# EAGLE design CircuitPlayground_ESP12_555_004 (EAGLE 7.1.0)
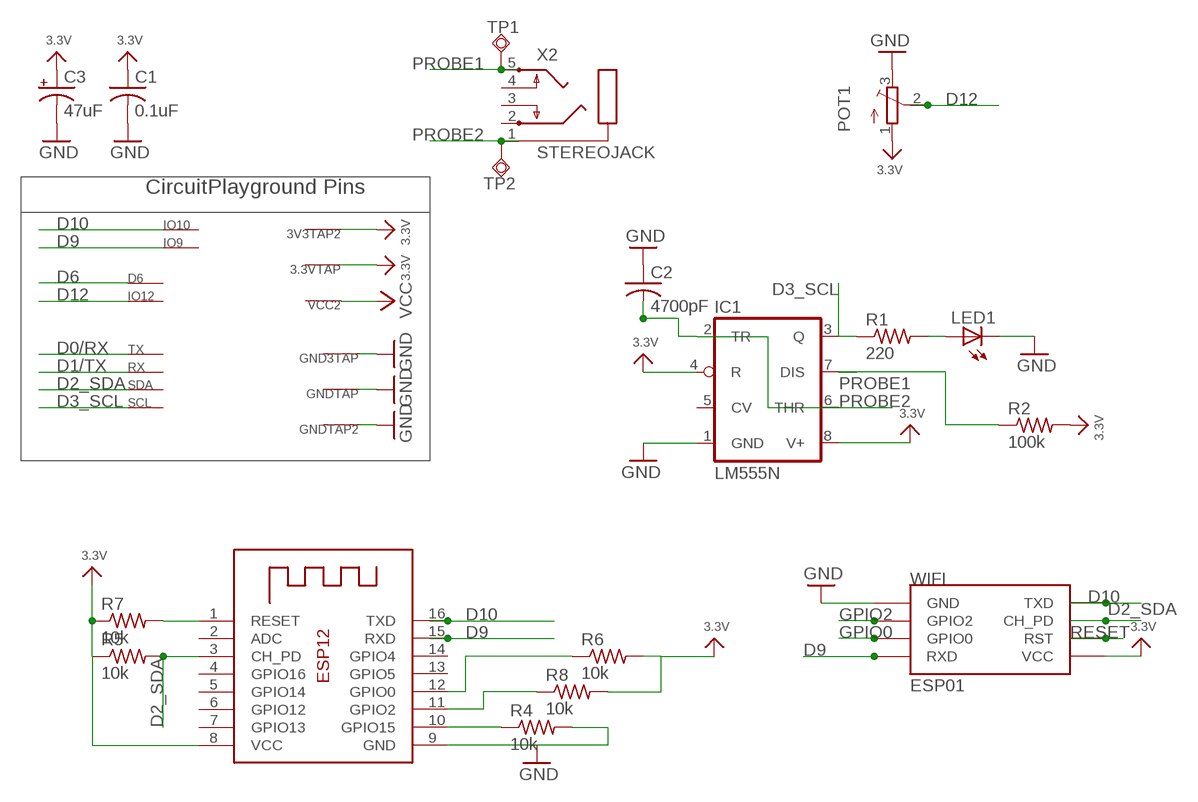
[diagram p0: schematic, sheet 1]

## Parts
3.3VTAP  SEWTAP-ALLIGATOR  [SEWALLI]
3V3TAP2  SEWTAP-ALLIGATOR  [SEWALLI]
C1  0.1uF  C-US025-030X050  [C025-030X050]
C2  4700pF  C-US025-030X050  [C025-030X050]
C3  47uF  CPOL-USE2-4  [E2-4]
D6  SEWTAP-ALLIGATOR  [SEWALLI]
GND3TAP  SEWTAP-ALLIGATOR  [SEWALLI]
GNDTAP  SEWTAP-ALLIGATOR  [SEWALLI]
GNDTAP2  SEWTAP-ALLIGATOR  [SEWALLI]
IC1  LM555N  [DIL08-ROUND]
IO9  SEWTAP-ALLIGATOR  [SEWALLI]
IO10  SEWTAP-ALLIGATOR  [SEWALLI]
IO12  SEWTAP-ALLIGATOR  [SEWALLI]
LED1  LED5MM  [LED5MM]
POT1  TRIMPOT3386  [TRIM-3386]
R1  220  R-US_R1206  [R1206]
R2  100k  R-US_R1206  [R1206]
R4  10k  R-US_R1206  [R1206]
R5  10k  R-US_R1206  [R1206]
R6  10k  R-US_R1206  [R1206]
R7  10k  R-US_R1206  [R1206]
R8  10k  R-US_R1206  [R1206]
RX  SEWTAP-ALLIGATOR  [SEWALLI]
SCL  SEWTAP-ALLIGATOR  [SEWALLI]
SDA  SEWTAP-ALLIGATOR  [SEWALLI]
TP1  TPSQTP20R  [TP20R]
TP2  TPSQTP20R  [TP20R]
TX  SEWTAP-ALLIGATOR  [SEWALLI]
VCC2  SEWTAP-ALLIGATOR  [SEWALLI]
WIFI  ESP01  [ESP01]
X1  ESP-12  [ESP-12]
X2  STEREOJACK  [STX3100]

## Nets
3.3V: 3.3VTAP.P$1(SEW) 3V3TAP2.P$1(SEW) C1.1 C3.+ IC1.4(R) IC1.8(V+) POT1.1(A) R2.2 R5.1 R6.2 R7.1 R8.2 WIFI.VCC X1.8(VCC)
D0/RX: TX.P$1(SEW)
D1/TX: RX.P$1(SEW)
D2_SDA: R5.2 SDA.P$1(SEW) WIFI.CH_PD X1.3(CH_PD)
D3_SCL: IC1.3(Q) R1.1 SCL.P$1(SEW)
D6: D6.P$1(SEW)
D9: IO9.P$1(SEW) WIFI.RX(RXD) X1.15(RXD)
D10: IO10.P$1(SEW) WIFI.TX(TXD) X1.16(TXD)
D12: IO12.P$1(SEW) POT1.2(S)
GND: C1.2 C2.1 C3.- GND3TAP.P$1(SEW) GNDTAP2.P$1(SEW) GNDTAP.P$1(SEW) IC1.1(GND) LED1.K(C) POT1.3(E) R4.2 WIFI.GND X1.9(GND)
GPIO0: R6.1 WIFI.GPIO0 X1.12(GPIO0)
GPIO2: R8.1 WIFI.GPIO2 X1.11(GPIO2)
N$1: R4.1 X1.10(GPIO15)
N$2: LED1.A R1.2
PROBE1: IC1.7(DIS) R2.1 TP1.TP X2.5
PROBE2: C2.2 IC1.2(TR) IC1.6(THR) TP2.TP X2.1
RESET: R7.2 WIFI.RST X1.1(RESET)
VCC: VCC2.P$1(SEW)
Unconnected: IC1.5(CV) X1.2(ADC) X1.4(GPIO16) X1.5(GPIO14) X1.6(GPIO12) X1.7(GPIO13) X1.13(GPIO5) X1.14(GPIO4) X2.2 X2.3 X2.4

## Notes on the sheet
- CircuitPlayground Pins

## Library data of the parts
3.3VTAP 3V3TAP2 D6 GND3TAP GNDTAP GNDTAP2 IO9 IO10 IO12 RX SCL SDA TX VCC2 = microbuilder:SEWTAP
C1 C2 = adafruit:C-US: CAPACITOR, American symbol
C3 = adafruit:CPOL-US: POLARIZED CAPACITOR, American symbol
IC1 = adafruit:*555: TIMER Changed DIP package to have round (not oval) pin pads http://www.ladyada.net/library/pcb/eaglelibrary.html
LED1 = adafruit:LED: LED OSRAM: - CHIPLED LG R971, LG N971, LY N971, LG Q971, LY Q971, LO R971, LY R971 LH N974, LH R974 LS Q976, LO Q976, LY Q976 LO Q996 - Hyper CHIPLED LW Q18S LB Q993, LB Q99A, LB R99A - SideLED LS A670, LO A670, LY A670, LG A670, LP A670 LB A673, LV A673, LT A673, LW A673 LH A674 LY A675 LS A676, LA A676, LO A676, LY A676, LW A676 LS A679, LY A679, LG A679 - Hyper Micro SIDELED® LS Y876, LA Y876, LO Y876, LY Y876 LT Y87S - SmartLED LW L88C, LW L88S LB L89C, LB L89S, LG L890 LS L89K, LO L89K, LY L89K LS L896, LA L896, LO L896, LY L896 - TOPLED LS T670, LO T670, LY T670, LG T670, LP T670 LSG T670, LSP T670, LSY T670, LOP T670, LYG T670 LG T671, LOG T671, LSG T671 LB T673, LV T673, LT T673, LW T673 LH T674 LS T676, LA T676, LO T676, LY T676, LB T676, LH T676, LSB T676, LW T676 LB T67C, LV T67C, LT T67C, LS T67K, LO T67K, LY T67K, LW E67C LS E67B, LA E67B, LO E67B, LY E67B, LB E67C, LV E67C, LT E67C LW T67C LS T679, LY T679, LG T679 LS T770, LO T770, LY T770, LG T770, LP T770 LB T773, LV T773, LT T773, LW T773 LH T774 LS E675, LA E675, LY E675, LS T675 LS T776, LA T776, LO T776, LY T776, LB T776 LHGB T686 LT T68C, LB T68C - Hyper Mini TOPLED® LB M676 - Mini TOPLED Santana® LG M470 LS M47K, LO M47K, LY M47K Source: http://www.osram.convergy.de/
POT1 = adafruit:TRIMPOT: SMT trimmer potentiometer part number TC33X http://www.ladyada.net/library/eagle
R1 R2 R4-R8 = adafruit:R-US_: RESISTOR, American symbol
TP1 TP2 = testpad:TPSQ: Test pad
WIFI = esp8266modules:ESP01: ESP8266 Wifi module 01
X1 = adafruit:ESP-12
X2 = adafruit:STEREOJACK: MIC/HEADPHONE JACK Stereo jack with two switches. Kycon STX3100, CUI SJ1-3555NG and/or 4UCon 05544

## Board
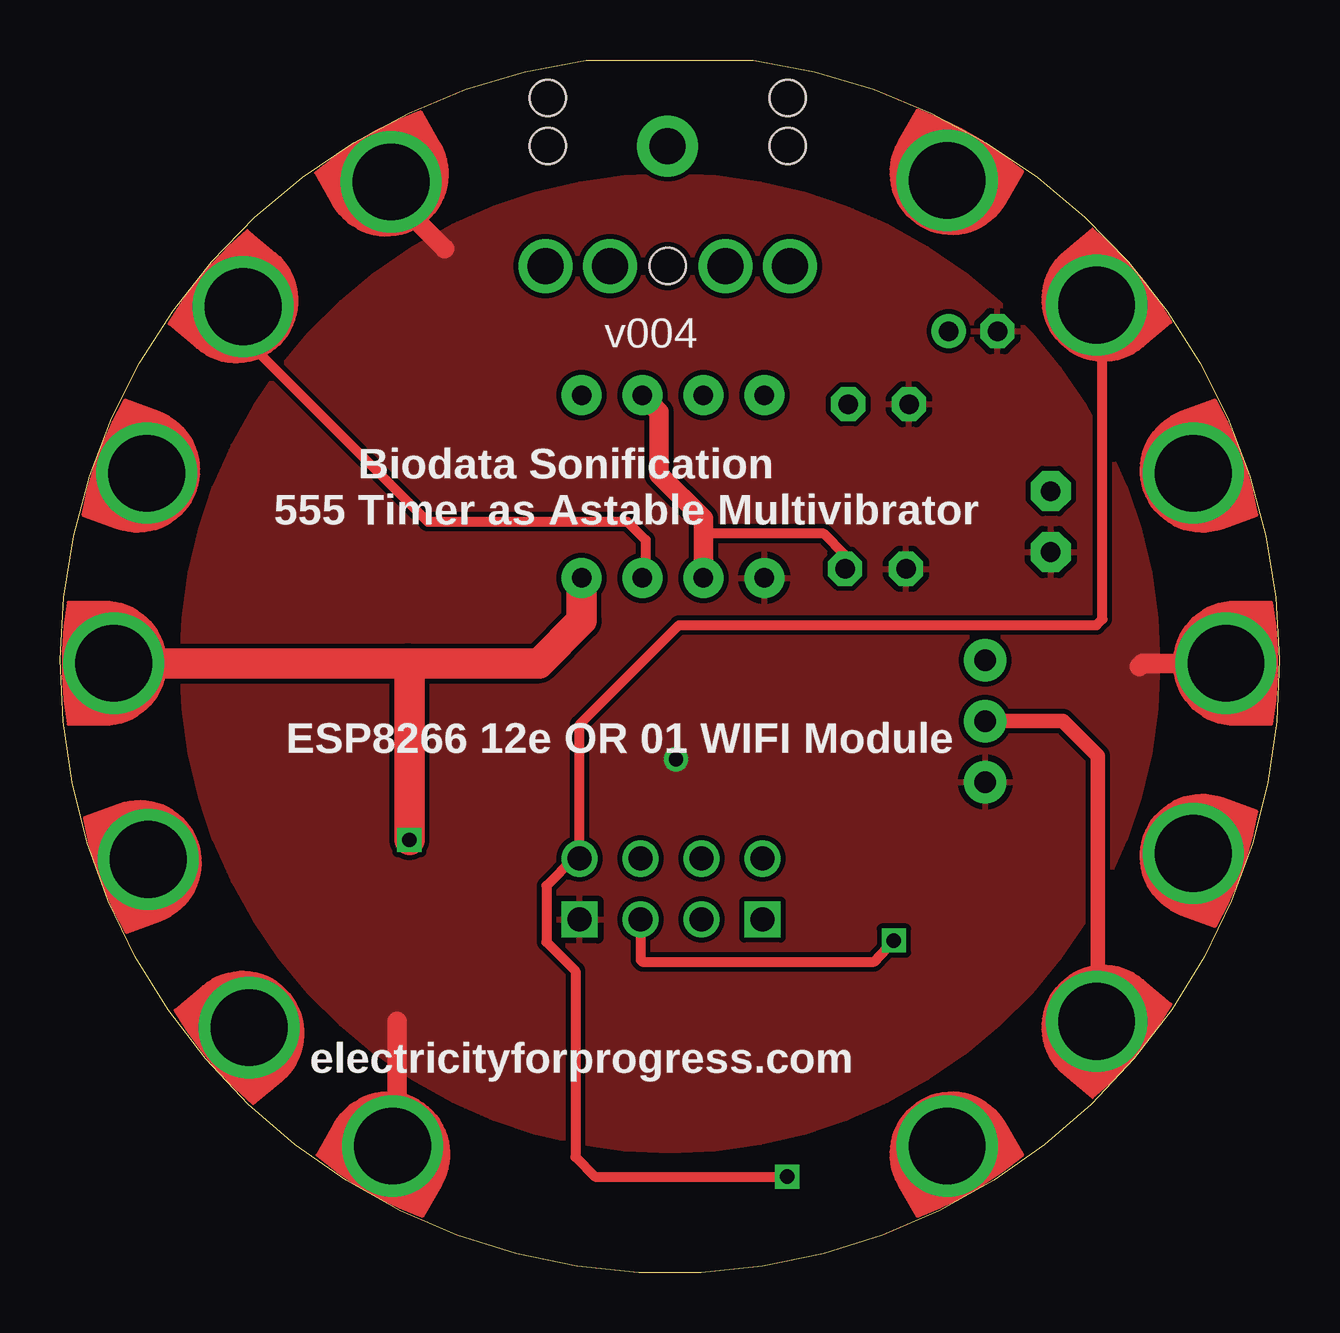
[diagram p1: board, top side]
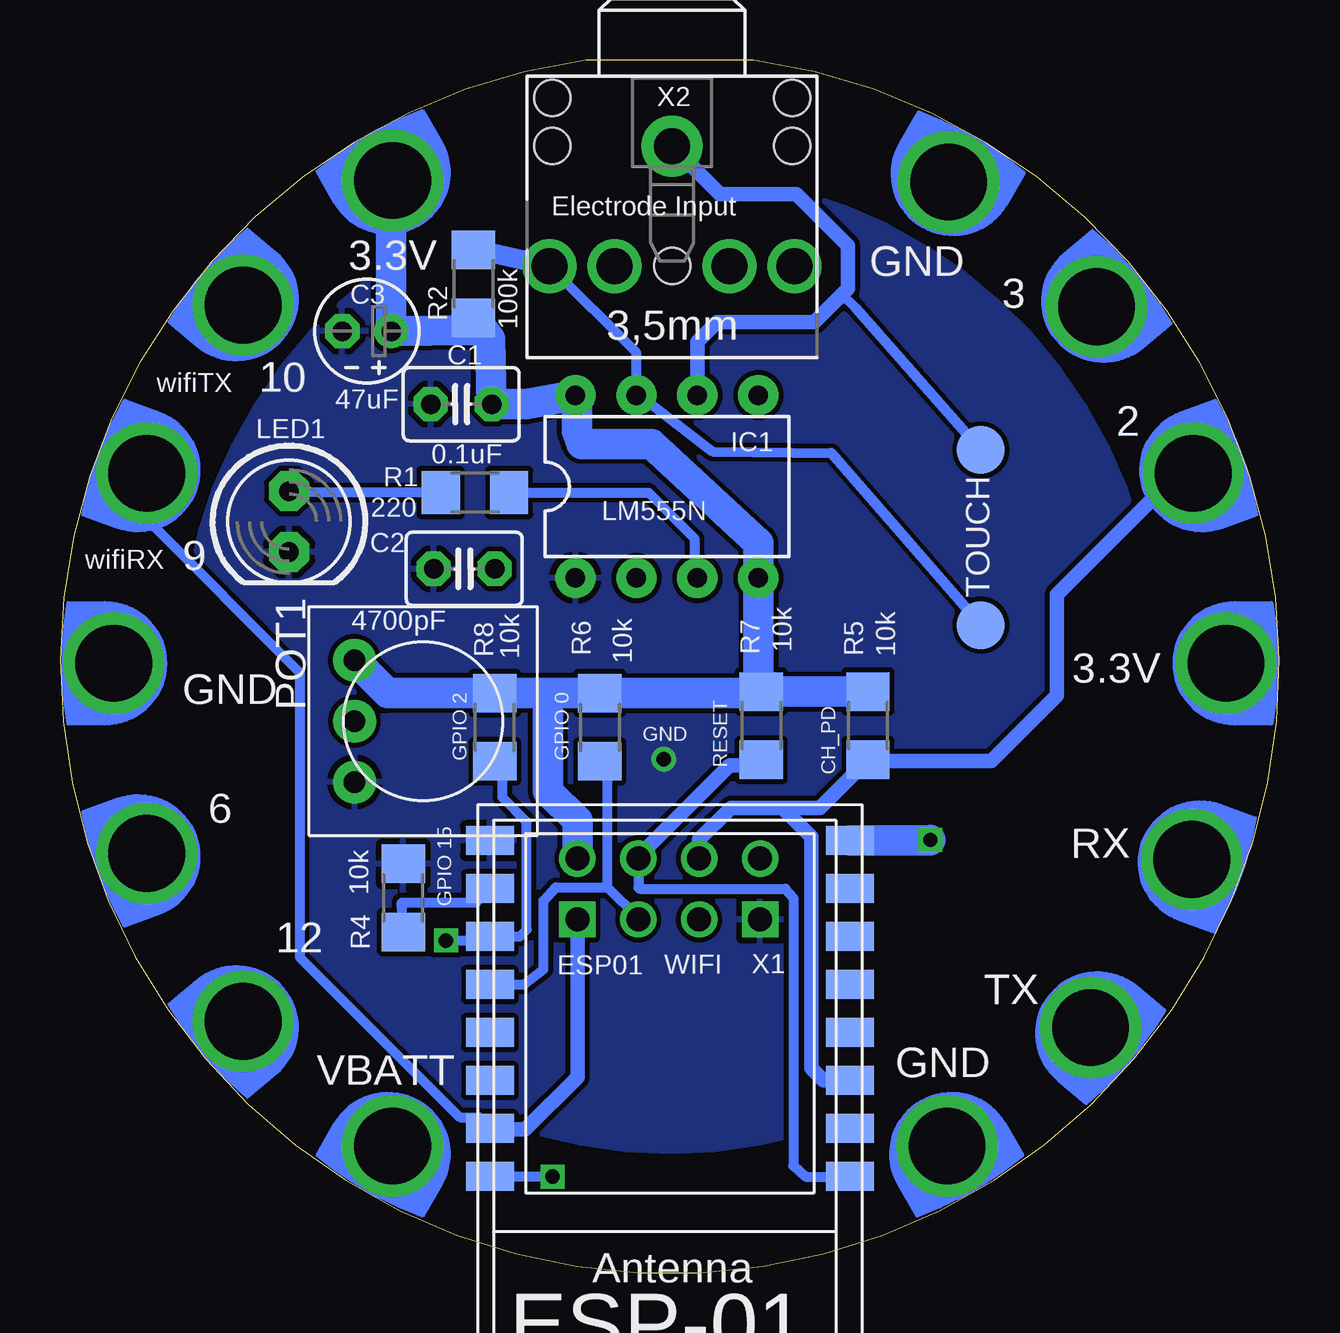
[diagram p2: board, bottom side, seen from below]

Size 50.82 x 50.55 mm. Coordinates in mm from the lower left corner, seen from the top.
Outline: 21.92,50.55 28.9,50.55 arc-344 21.92,50.55
Copper layers (1*16): Top 0.035mm / dielectric 1.5mm / Bottom 0.035mm
Design rules "adafruit *": minimum track width 8mil, minimum drill 15.5mil, track to track 8mil, track to pad 8mil, pad to pad 8mil, via to via 8mil, smd to smd 8mil, copper to edge 10mil, drill to drill 8mil, minimum pad ring 10mil, minimum via ring 8mil, stop-mask expansion 2mil, vias tented up to drill 20mil, thermal gap 10mil

### Footprints (pad centres in the part's own frame; a part is rotated, then mirrored left to right if it is on the bottom)
SEWALLI = drill 3.2: P$1 0,0.508
C025-030X050 = drill 0.813 pad 1.422 octagon: 1 -1.27,0; 2 1.27,0
E2-4 = drill 0.813 pad 1.422: + -1.016,0 | drill 0.813 pad 1.422 octagon: - 1.016,0
DIL08-ROUND = drill 0.813 pad 1.676: 1 -3.81,-3.81; 2 -1.27,-3.81; 3 1.27,-3.81; 4 3.81,-3.81; 5 3.81,3.81; 6 1.27,3.81; 7 -1.27,3.81; 8 -3.81,3.81
LED5MM = drill 0.813 pad 1.676 octagon: A -1.27,0; K 1.27,0
TRIM-3386 = drill 0.9 pad 1.778: 1 -2.54,-2.857; 2 0,-2.857; 3 2.54,-2.857
R1206 = smd 1.6 x 1.803: 1 -1.422,0; 2 1.422,0
TP20R = smd 2 x 2: TP 0,0
ESP01 = drill 1: CH_PD -1.285,-8.178; GPIO0 1.255,-5.638; GPIO2 -1.285,-5.638; RST 1.255,-8.178; TX -3.825,-8.178; VCC 3.795,-8.178 | drill 1 square: GND -3.825,-5.638; RX 3.795,-5.638
ESP-12 = smd 2 x 1.2: 1 -7.5,4.5; 2 -7.5,2.5; 3 -7.5,0.5; 4 -7.5,-1.5; 5 -7.5,-3.5; 6 -7.5,-5.5; 7 -7.5,-7.5; 8 -7.5,-9.5; 9 7.5,-9.5; 10 7.5,-7.5; 11 7.5,-5.5; 12 7.5,-3.5; 13 7.5,-1.5; 14 7.5,0.5; 15 7.5,2.5; 16 7.5,4.5
STX3100 = drill 1.5 pad 2.54: 1 2.7,-0.1 | drill 1.5: 2 7.7,5; 3 7.7,2.3; 4 7.7,-2.5; 5 7.7,-5.2 | hole 1.5: 2.7,4.9; 2.7,-5.1; 7.7,-0.1; 0.7,4.9; 0.7,-5.1

### Placement (x,y rotation side)
3.3VTAP  2.74,25.4 90 top
3V3TAP2  36.71,45.09 330 top
C1  34.11,36.2 180 bottom
C2  33.98,29.34 0 bottom
C3  38.05,39.24 180 bottom
D6  46.75,17.65 250 top
GND3TAP  14.04,45.02 30 top
GNDTAP  48.08,25.4 270 top
GNDTAP2  14.11,5.72 150 top
IC1  25.54,32.77 0 bottom
IO9  46.75,33.15 290 top
IO10  42.81,40.01 310 top
IO12  42.81,10.8 230 top
LED1  41.28,31.31 270 bottom
POT1  35.7,22.99 270 bottom
R1  33.54,32.51 180 bottom
R2  33.6,41.21 270 bottom
R4  36.52,15.62 90 bottom
R5  17.15,22.8 270 bottom
R6  28.33,22.73 90 bottom
R7  21.6,22.8 270 bottom
R8  32.71,22.73 90 bottom
RX  4.14,17.4 110 top
SCL  8.01,39.94 50 top
SDA  4.07,33.15 70 top
TP1  12.46,26.99 0 bottom
TP2  12.46,34.29 0 bottom
TX  8.26,10.54 130 top
VCC2  36.71,5.72 210 top
WIFI  25.47,9.08 180 bottom
X1  25.41,8.51 180 bottom
X2  25.22,49.66 270 bottom

### Tracks (layer width: path | path; a pad name or v marks a point on that pad's centre or on a via)
3.3V  (via drill 0.6)
  Top 1.27: 3.3VTAP.P$1 14.49,25.4 | 14.49,25.4 19.95,25.4 21.73,27.18 IC1.4 | v14.55,18.03 14.55,25.34 14.49,25.4
  Bottom 0.406: R8.2 32.14,24.16 32.14,24.13
  Bottom 0.61: 29.28,36.51 IC1.8
  Bottom 1.016: R2.2 33.63,39.28 | 37.03,44.77 36.9,44.89 36.9,45.46 3V3TAP2.P$1
  Bottom 1.27: 29.28,36.51 29.28,35.05 29.09,34.54 26.17,34.54 21.73,30.42 IC1.4 21.73,24.35 R7.1 | IC1.8 31.38,36.2 C1.1 32.9,38.9 R2.2 | 33.63,39.28 C3.+ 37.03,44.77 | 30.49,24.16 R6.2 21.66,24.16 R7.1 | 30.49,24.16 32.12,24.16 32.14,24.13 | R8.2 37.18,24.16 POT1.1 | WIFI.VCC 29.27,18.84 30.49,20.07 30.49,24.16 | R7.1 R5.1 | X1.8 14.58,18.01 v14.55,18.03
D2_SDA
  Bottom 0.406: 3.5,32.32 3.5,33.23 SDA.P$1
  Bottom 0.61: WIFI.CH_PD 24.19,18.05 22.87,19.37 20.71,19.37 | 20.71,19.37 19.16,19.37 R5.2 17.12,21.34 12.01,21.34 9.28,24.07 9.28,28.26 5.22,32.32 3.5,32.32 | X1.3 19,8.01 19.5,8.51 19.5,18.16 20.71,19.37
D3_SCL
  Top 0.406: SCL.P$1 7.62,39 15.31,31.31 23.63,31.31 24.39,30.54 24.39,29.08 IC1.3
  Bottom 0.406: R1.1 26.3,32.51 24.39,30.61 24.39,29.08 IC1.3
D9
  Bottom 0.406: IO9.P$1 47.22,31.4 40.84,25.02 40.84,13.15 34.17,6.48 33.38,6.48 X1.15
  Bottom 0.61: WIFI.RX 29.27,8.14 31.44,5.97 32.87,5.97 X1.15
D10  (via drill 0.6)
  Top 0.406: v30.3,4 22.3,4 21.47,4.83 21.47,12.57 20.27,13.78 20.27,16.13 21.4,17.26 WIFI.TX 21.65,22.85 25.79,26.99 43.19,26.99 43.44,27.24 43.44,40.09 IO10.P$1
  Bottom 0.406: v30.3,4 X1.16
D12
  Top 0.61: POT1.2 41.79,22.99 43.25,21.53 43.25,10.52 IO12.P$1
GND  (via drill 0.6)
  Top 0.813: GND3TAP.P$1 13.79,44.89 16.01,42.67 | GNDTAP.P$1 45.09,25.4 44.97,25.27 | GNDTAP2.P$1 14.04,5.28 14.04,10.48
  other vias: 25.66,21.4
  pour Bottom: 25.41,5.08 arc-90 5.09,25.4 arc-90 25.41,45.72 arc-90 45.73,25.4 arc-90
  pour Top: 25.41,5.08 arc-90 5.09,25.4 arc-90 25.41,45.72 arc-90 45.73,25.4 arc-90
GPIO0
  Bottom 0.406: WIFI.GPIO0 26.73,14.78 28.01,16.07 | 28.01,16.07 28.01,20.99 R6.1 | X1.12 31.5,12.01 30.68,12.64 30.68,15.49 30.17,16.07 28.01,16.07
GPIO2  (via drill 0.6)
  Top 0.406: WIFI.GPIO2 24.19,13.03 24.27,12.95 33.92,12.95 v34.74,13.84
  Bottom 0.406: R8.1 32.39,20.99 32.39,19.81 31.38,18.8 31.38,14.29 31.66,14.01 X1.11 33.08,13.84 v34.74,13.84
N$1
  Bottom 0.406: R4.1 36.59,15.43 33.49,15.43 X1.10
N$2
  Bottom 0.406: R1.2 40.01,32.51 LED1.A
PROBE1
  Bottom 0.406: X2.5 26.81,38.34 IC1.7 26.68,36.58 23.63,34.23 18.68,34.16 TP1.TP
  Bottom 0.813: X2.5 32.99,42.53 R2.1
PROBE2
  Top 0.406: C2.2 32.71,29.91 31.82,30.8 27,30.8 26.81,30.61
  Top 0.813: IC1.2 26.81,30.61 26.81,31.43 24.96,33.27 24.96,35.88 IC1.6
  Bottom 0.406: TP2.TP 17.66,40.2 18.23,40.77
  Bottom 0.61: IC1.6 24.27,38.8 23.44,39.62 19.38,39.62 18.23,40.77 17.98,41.02 17.98,42.8 20.14,44.96 23.32,44.96 X2.1
RESET
  Bottom 0.406: WIFI.RST 26.73,16.05 26.68,16 20.58,16 20.27,15.62 20.27,4.45 19.76,4 X1.1
  Bottom 0.61: WIFI.RST 26.73,17.35 22.93,21.15 21.83,21.15 R7.2

### Text on the board
tNames: v004 | Biodata Sonification / 555 Timer as Astable Multivibrator / / / / / ESP8266 12e OR 01 WIFI Module / / / / / / / electricityforprogress.com
bNames: Electrode Input | GND | 3.3V | 3 | 10 | wifiTX | 2 | 9 | wifiRX | TOUCH | 3.3V | GPIO 0 | GPIO 2 | CH_PD | RESET | GND | GND | GPIO 15 | 6 | RX | 12 | TX | GND | VBATT
tStop: Electricity for Progress 2017